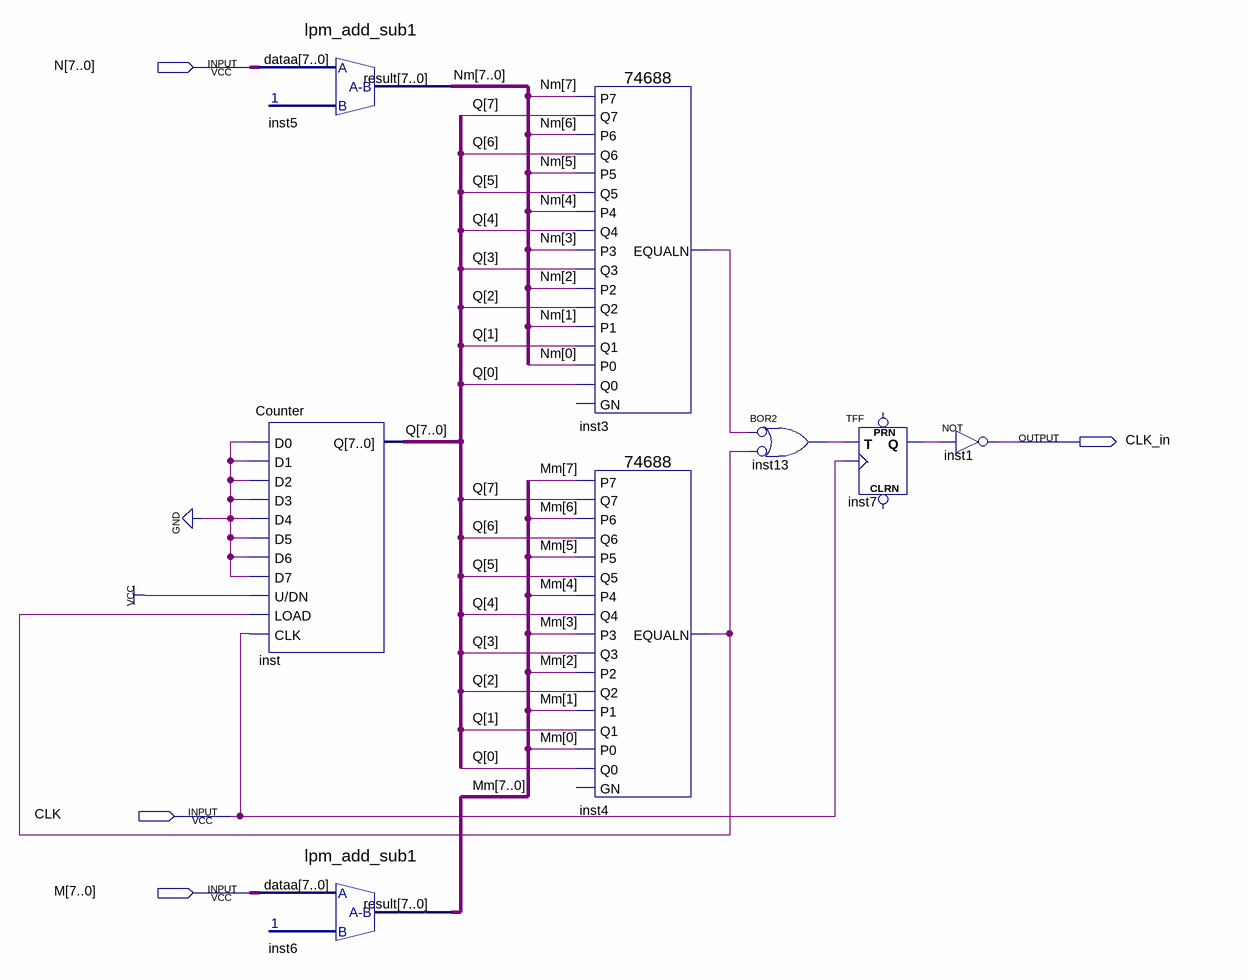
[diagram p0: schematic sheet]
// Quartus schematic block1.bdf as structural Verilog: 8 symbols, 4 pins
module block1 (
  input  [7:0] N,
  input  CLK,
  input  [7:0] M,
  output CLK_in
);

  wire inst3_equaln, inst4_equaln, inst7_q, inst13_out;
  wire [7:0] Mm, Nm, Q;

  lpm_add_sub1 inst5 (.dataa(N), .result(Nm));
  Counter inst (
    .D0(1'b0), .D1(1'b0), .D2(1'b0), .D3(1'b0), .D4(1'b0), .D5(1'b0), .D6(1'b0), .D7(1'b0), .\U/DN (1'b1),
    .LOAD(inst4_equaln), .CLK(CLK), .Q(Q));
  lpm_add_sub1 inst6 (.dataa(M), .result(Mm));
  \74688  inst3 (
    .P6(Nm[6]), .Q3(Q[3]), .P3(Nm[3]), .Q4(Q[4]), .P4(Nm[4]), .Q2(Q[2]), .P1(Nm[1]), .Q1(Q[1]), .P0(Nm[0]),
    .Q0(Q[0]), .P2(Nm[2]), .Q7(Q[7]), .Q5(Q[5]), .P5(Nm[5]), .Q6(Q[6]), .P7(Nm[7]), .EQUALN(inst3_equaln));  // open: GN
  \74688  inst4 (
    .P6(Mm[6]), .Q3(Q[3]), .P3(Mm[3]), .Q4(Q[4]), .P4(Mm[4]), .Q2(Q[2]), .P1(Mm[1]), .Q1(Q[1]), .P0(Mm[0]),
    .Q0(Q[0]), .P2(Mm[2]), .Q7(Q[7]), .Q5(Q[5]), .P5(Mm[5]), .Q6(Q[6]), .P7(Mm[7]), .EQUALN(inst4_equaln));  // open: GN
  or inst13 (inst13_out, ~inst3_equaln, ~inst4_equaln);  // BOR2
  TFF inst7 (.T(inst13_out), .CLK(CLK), .Q(inst7_q));  // open: PRN, CLRN
  not inst1 (CLK_in, inst7_q);
endmodule
